# EAGLE design OR (EAGLE 7.4.0)
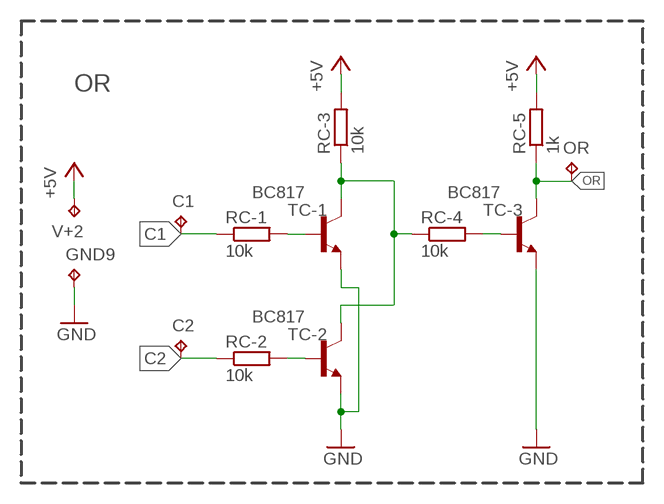
[diagram p0: schematic, sheet 1]

## Parts
C1  TPTP07R  [TP07R]
C2  TPTP07R  [TP07R]
GND9  TPTP07R  [TP07R]
OR  TPTP07R  [TP07R]
RC-1  10k  R-EU_R0603  [R0603]
RC-2  10k  R-EU_R0603  [R0603]
RC-3  10k  R-EU_R0603  [R0603]
RC-4  10k  R-EU_R0603  [R0603]
RC-5  1k  R-EU_R0603  [R0603]
TC-1  BC817  BC817-40-NPN-SOT23-BEC  [SOT23-BEC]
TC-2  BC817  BC817-40-NPN-SOT23-BEC  [SOT23-BEC]
TC-3  BC817  BC817-40-NPN-SOT23-BEC  [SOT23-BEC]
V+2  TPTP07R  [TP07R]

## Nets
+5V: RC-3.2 RC-5.2 V+2.TP
C1: C1.TP RC-1.1
C2: C2.TP RC-2.1
GND: GND9.TP TC-1.E TC-2.E TC-3.E
N$7: RC-1.2 TC-1.B
N$9: RC-2.2 TC-2.B
N$10: RC-4.2 TC-3.B
N$11: RC-3.1 RC-4.1 TC-1.C TC-2.C
OR: OR.TP RC-5.1 TC-3.C

## Notes on the sheet
- OR

## Library data of the parts
C1 C2 GND9 OR V+2 = testpad:TP: Test pad
RC-1-RC-5 = p.peter-rcl:R-EU_: RESISTOR, European symbol
TC-1-TC-3 = transistor:*-NPN-: NPN Transistror BF959 corrected 2008.03.06

## Board
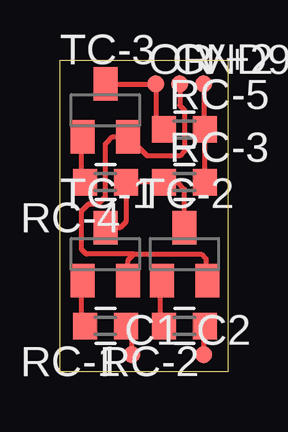
[diagram p1: board, top side]
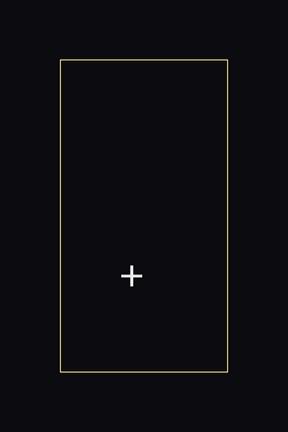
[diagram p2: board, bottom side, seen from below]

Size 7 x 13 mm. Coordinates in mm from the lower left corner, seen from the top.
Outline: 0,0 0,13 7,13 7,0 0,0
Copper layers (1*16): Top 0.035mm / dielectric 1.5mm / Bottom 0.035mm
Design rules "Fusion_eagle_rule_v1.1 *": minimum track width 6mil, minimum drill 12mil, track to track 6mil, track to pad 6mil, pad to pad 6mil, via to via 6mil, smd to smd 0mil, copper to edge 10mil, drill to drill 10mil, minimum pad ring 15mil, minimum via ring 6mil, stop-mask expansion 2mil, vias tented up to drill 100mil, thermal gap 10mil

### Footprints (pad centres in the part's own frame; a part is rotated, then mirrored left to right if it is on the bottom)
TP07R = smd 0.7 x 0.7: TP 0,0
R0603 = smd 1 x 1.1: 1 -0.85,0; 2 0.85,0
SOT23-BEC = smd 1 x 1.4: B -0.95,-1.1; C 0,1.1; E 0.95,-1.1

### Placement (x,y rotation side)
C1  3,0.7 0 top
C2  6,0.7 0 top
GND9  5,12 0 top
OR  4,12 0 top
RC-1  1.9,1.9 180 top
RC-2  5.2,1.9 180 top
RC-3  5.2,7.9 0 top
RC-4  1.9,7.9 180 top
RC-5  5.2,10.1 0 top
TC-1  1.9,4.9 0 top
TC-2  5.2,4.9 0 top
TC-3  1.9,10.9 0 top
V+2  6,12 0 top

### Tracks (layer width: path | path; a pad name or v marks a point on that pad's centre or on a via)
+5V
  Top 0.2: RC-3.2 RC-5.2 6,10.05 V+2.TP
C1
  Top 0.2: C1.TP 3,1.8 2.9,1.85 RC-1.1
C2
  Top 0.2: C2.TP 6,1.95 RC-2.1
GND
  Top 0.2: TC-1.E 2.85,4.65 3.1,4.9 | 3.1,4.9 5.9,4.9 6.1,4.7 6.1,3.85 TC-2.E | GND9.TP 5,11.1 5.2,10.9 5.2,9.2 5,9 3.65,9 TC-3.E 2.2,9.8 1.9,9.5 1.9,7.3 1.6,7 1.2,7 0.9,6.7 0.9,5.1 1.1,4.9 3.1,4.9
N$7
  Top 0.2: RC-1.2 1,1.9 0.9,2 0.9,3.75 TC-1.B
N$9
  Top 0.2: RC-2.2 4.2,1.9 4.2,3.75 TC-2.B
N$10
  Top 0.2: RC-4.2 0.9,7.9 0.9,9.75 TC-3.B
N$11
  Top 0.2: TC-2.C 5.2,7.6 4.9,7.9 RC-3.1 RC-4.1 2.75,6.25 2.5,6 TC-1.C
OR
  Top 0.2: TC-3.C 3.8,12 OR.TP 4,10.45 RC-5.1

### Text on the board
bPlace: +
Document: OR